# Altium schematic sheet Power Board.SchDoc
size A4
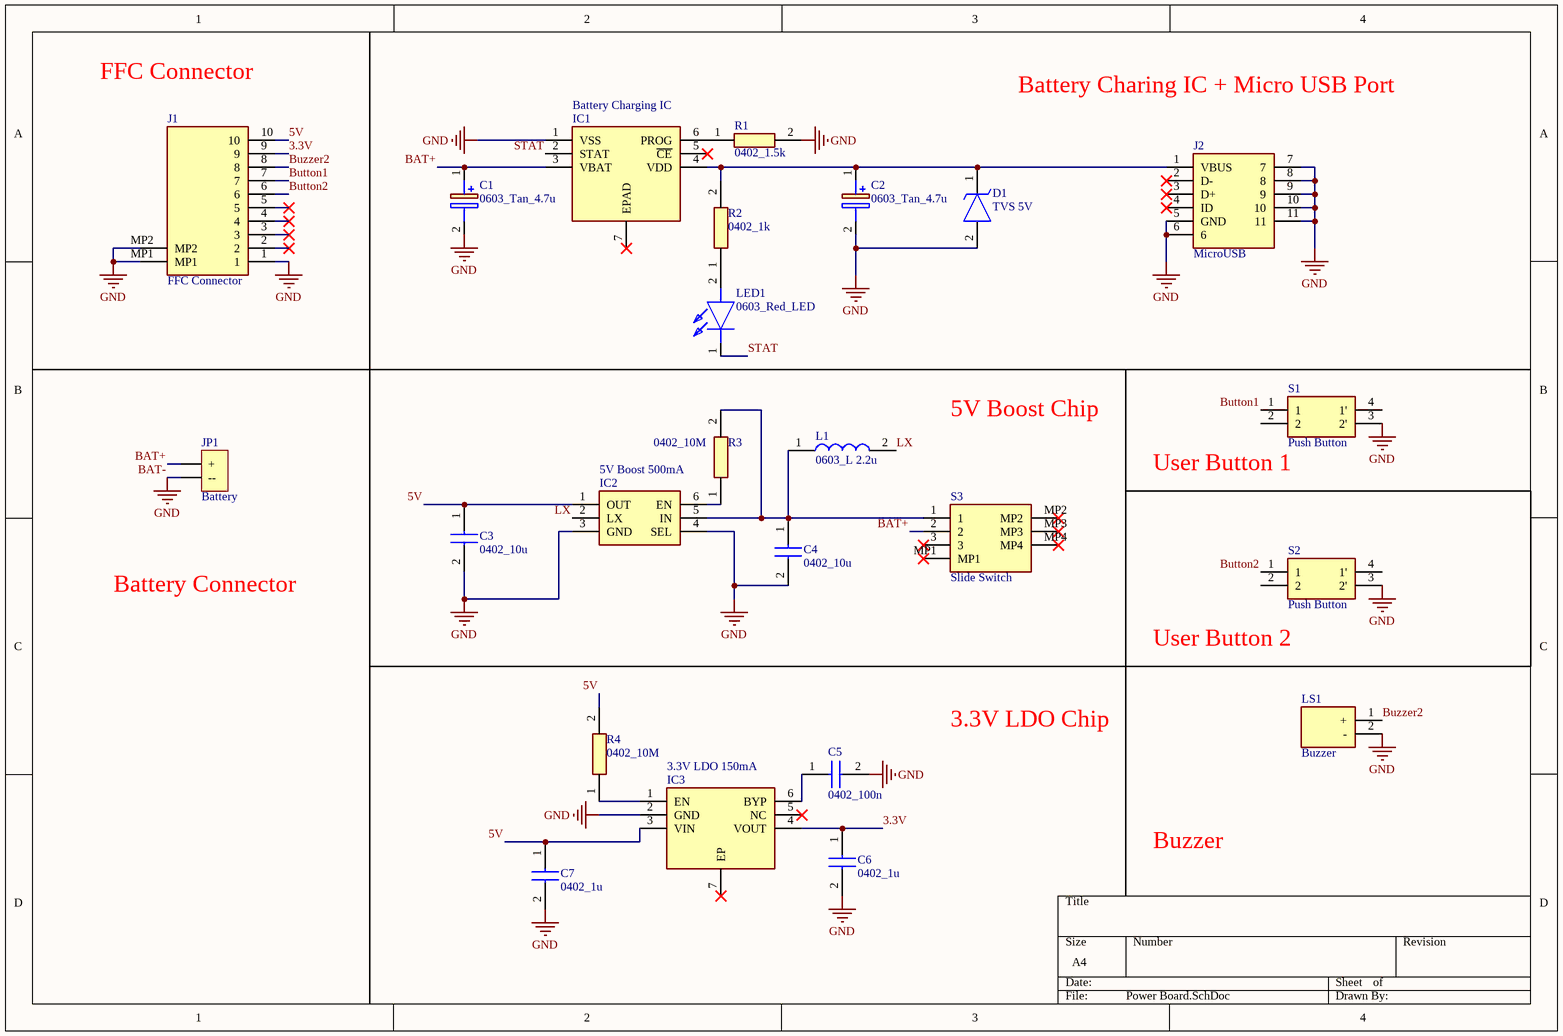
[diagram p0: Power Board.SchDoc]

## Parts
C1  0603_Tan_4.7u  [CAPPM168X90N]
C2  0603_Tan_4.7u  [CAPPM168X90N]
C3  0402_10u  [CAPC1005X55N]
C4  0402_10u  [CAPC1005X55N]
C5  0402_100n  [0402_CAP]
C6  0402_1u  [CAPC1005X55N]
C7  0402_1u  [CAPC1005X55N]
D1  TVS 5V  [SODFL1006X40N]
IC1  Battery Charging IC  [SON50P200X200X80-7N-D]
IC2  5V Boost 500mA  [SON65P200X200X80-6N]
IC3  3.3V LDO 150mA  [SON65P200X200X90-7N-D]
J1  FFC Connector  [528921033]
J2  MicroUSB  [473461001]
JP1  Battery  [Buzzer & Battery]
L1  0603_L 2.2u  [Inductor]
LED1  0603_Red_LED  [LEDC1608X80N]
LS1  Buzzer  [Buzzer & Battery]
R1  0402_1.5k  [0402_R]
R2  0402_1k  [0402_R]
R3  0402_10M  [0402_R]
R4  0402_10M  [0402_R]
S1  Push Button  [Push_Button]
S2  Push Button  [Push_Button]
S3  Slide Switch  [450404015514]

## Nets
BAT-: C1.2(-) C2.2(-) C3.2 C4.2 C5.2 C6.2 C7.2 D1.2(A) IC1.1(VSS) IC2.3(GND) IC2.4(SEL) IC3.2(GND) J1.1 J1.MP1 J1.MP2 J2.5(GND) J2.6 J2.7 J2.8 J2.9 J2.10 J2.11 JP1.2(--) LS1.2(-) R1.2 S1.3(2') S2.3(2')  [also labelled GND]
3.3V: C6.1 IC3.4(VOUT) J1.9
5V: C3.1 C7.1 IC2.1(OUT) IC3.3(VIN) J1.10 R4.2
BAT+: C1.1(+) IC1.3(VBAT) JP1.1(+) S3.2
Button1: J1.7 S1.1
Button2: J1.6 S2.1
Buzzer2: J1.8 LS1.1(+)
LX: IC2.2(LX) L1.2
STAT: IC1.2(STAT) LED1.1(K)
NetC2_1: C2.1(+) D1.1(K) IC1.4(VDD) J2.1(VBUS) R2.2
NetC4_1: C4.1 IC2.5(IN) L1.1 R3.2 S3.1
NetC5_1: C5.1 IC3.6(BYP)
NetIC1_6: IC1.6(PROG) R1.1
NetIC2_6: IC2.6(EN) R3.1
NetIC3_1: IC3.1(EN) R4.1
NetLED1_2: LED1.2(A) R2.1

Not connected (* = marked no-connect by the designer): IC1 5(~{CE})* 7(EPAD)*; IC3 5(NC)* 7(EP)*; J1 2* 3* 4* 5*; J2 2(D-)* 3(D+)* 4(ID)*; S1 2 4(1'); S2 2 4(1'); S3 3* MP1* MP2* MP3* MP4*

## Notes on the sheet
- FFC Connector
- Battery Charing IC + Micro USB Port
- 5V Boost Chip
- (near S1) User Button 1
- Battery Connector
- (near S2) User Button 2
- 3.3V LDO Chip
- Buzzer

## Library data of the parts
C1 C2 = 0603_Tan_4.7u: Capacitor Polarised; Manufacturer_Name: Vishay; Manufacturer_Part_Number: TMCJ0J475MTRF; Datasheet Link: https://componentsearchengine.com/Datasheets/1/TMCJ0J475MTRF.pdf; Height: 0.9mm
C3 C4 C6 C7 = 0402_C: Capacitor; Manufacturer_Name: Kemet; Manufacturer_Part_Number: C0402C474K8RACTU; Datasheet Link: https://content.kemet.com/datasheets/KEM_C1002_X7R_SMD.pdf; Height: 0.55mm
C5 = 0603_C: Capacitor; Manufacturer_Name: Vishay; Manufacturer_Part_Number: VJ0603HIFRQ1KIT; Datasheet Link: http://www.vishay.com/docs/45226/vj31xrohsautomlcc.pdf; Height: 0.97mm
D1 = TVS 5V: TVS Diode (Uni-directional); Manufacturer_Name: ON Semiconductor; Manufacturer_Part_Number: SZESD9101P2T5G; Datasheet Link: https://componentsearchengine.com//SZESD9101P2T5G.pdf; Height: 0.4mm; Mouser2 Part Number: 863-SZESD9101P2T5G; Mouser2 Price/Stock: https://www.mouser.com/Search/Refine.aspx?Keyword=863-SZESD9101P2T5G
IC1 = Battery Charging IC: Integrated Circuit; Manufacturer_Name: Microchip; Manufacturer_Part_Number: MCP73830LT-0AAI/MYY; Datasheet Link: https://componentsearchengine.com//MCP73830LT-0AAI_MYY.pdf; Height: 0.8mm; Mouser2 Part Number: 579-MCP73830LT0AAIMY; Mouser2 Price/Stock: https://www.mouser.com/Search/Refine.aspx?Keyword=579-MCP73830LT0AAIMY
IC2 = 5V Boost 500mA: Integrated Circuit; Manufacturer_Name: Maxim Integrated; Manufacturer_Part_Number: MAX17223ELT+T; Datasheet Link: https://datasheets.maximintegrated.com/en/ds/MAX17220-MAX17225.pdf; Height: 0.8mm
IC3 = 3.3V LDO 150mA: Integrated Circuit; Manufacturer_Name: Microchip; Manufacturer_Part_Number: MIC47050-1.8YML-TR; Datasheet Link: https://componentsearchengine.com/Datasheets/1/MIC47050-1.8YML-TR.pdf; Height: 0.9mm
J1 = FFC Connector: Connector; Manufacturer_Name: Molex; Manufacturer_Part_Number: 52892-1033; Datasheet Link: https://componentsearchengine.com/Datasheets/2/52892-1033.pdf; Height: 2mm
J2 = MicroUSB: Connector; Manufacturer_Name: Molex; Manufacturer_Part_Number: 47346-1001; Datasheet Link: http://www.molex.com/webdocs/datasheets/pdf/en-us/0473461001_IO_CONNECTORS.pdf; Height: 2.94mm
JP1 = Battery: HDR-1X2; BOM名称: 2P接插件; 版权归属: 源创客; 学习资源: www.ooocke.com
L1 = 0603_L 2.2u: Inductor; Manufacturer_Name: Pulse; Manufacturer_Part_Number: PE-0603CLH2R2STS; Datasheet Link: https://www.mouser.de/datasheet/2/336/PLEI_S_A0011079421_1-2514267.pdf; Height: 1mm
LED1 = 0603_Red_LED: LED; Manufacturer_Name: Wurth Elektronik; Manufacturer_Part_Number: 150060RS75000; Datasheet Link: http://katalog.we-online.de/led/datasheet/150060RS75000.pdf; Height: 0.8mm
LS1 = Buzzer: Loudspeaker or Buzzer; Manufacturer_Name: CUI Inc.; Manufacturer_Part_Number: CPT-12123-81-SMT-TR; Datasheet Link: https://www.cuidevices.com/product/resource/cpt-12123-81-smt-tr.pdf; Height: 3.3mm
R1-R4 = 0402_R: Resistor; Manufacturer_Name: Panasonic; Manufacturer_Part_Number: ERA-2ARB472X; Datasheet Link: http://industrial.panasonic.com/cdbs/www-data/pdf/RDM0000/AOA0000C307.pdf; Height: 0.4mm
S1 S2 = Push Button: Switch; Manufacturer_Name: Panasonic; Manufacturer_Part_Number: EVQ-9P701P; Datasheet Link: https://componentsearchengine.com//EVQ-9P701P.pdf; Mouser2 Part Number: 667-EVQ-9P701P; Mouser2 Price/Stock: https://www.mouser.com/Search/Refine.aspx?Keyword=667-EVQ-9P701P
S3 = Slide Switch: Switch; Manufacturer_Name: Wurth Elektronik; Datasheet Link: https://katalog.we-online.de/em/datasheet/450404015514.pdf; Height: 1.4mm; Manufacturer_Part_Number: 450404015514